# Altium schematic sheet Communication and peripherals.SchDoc
size A4
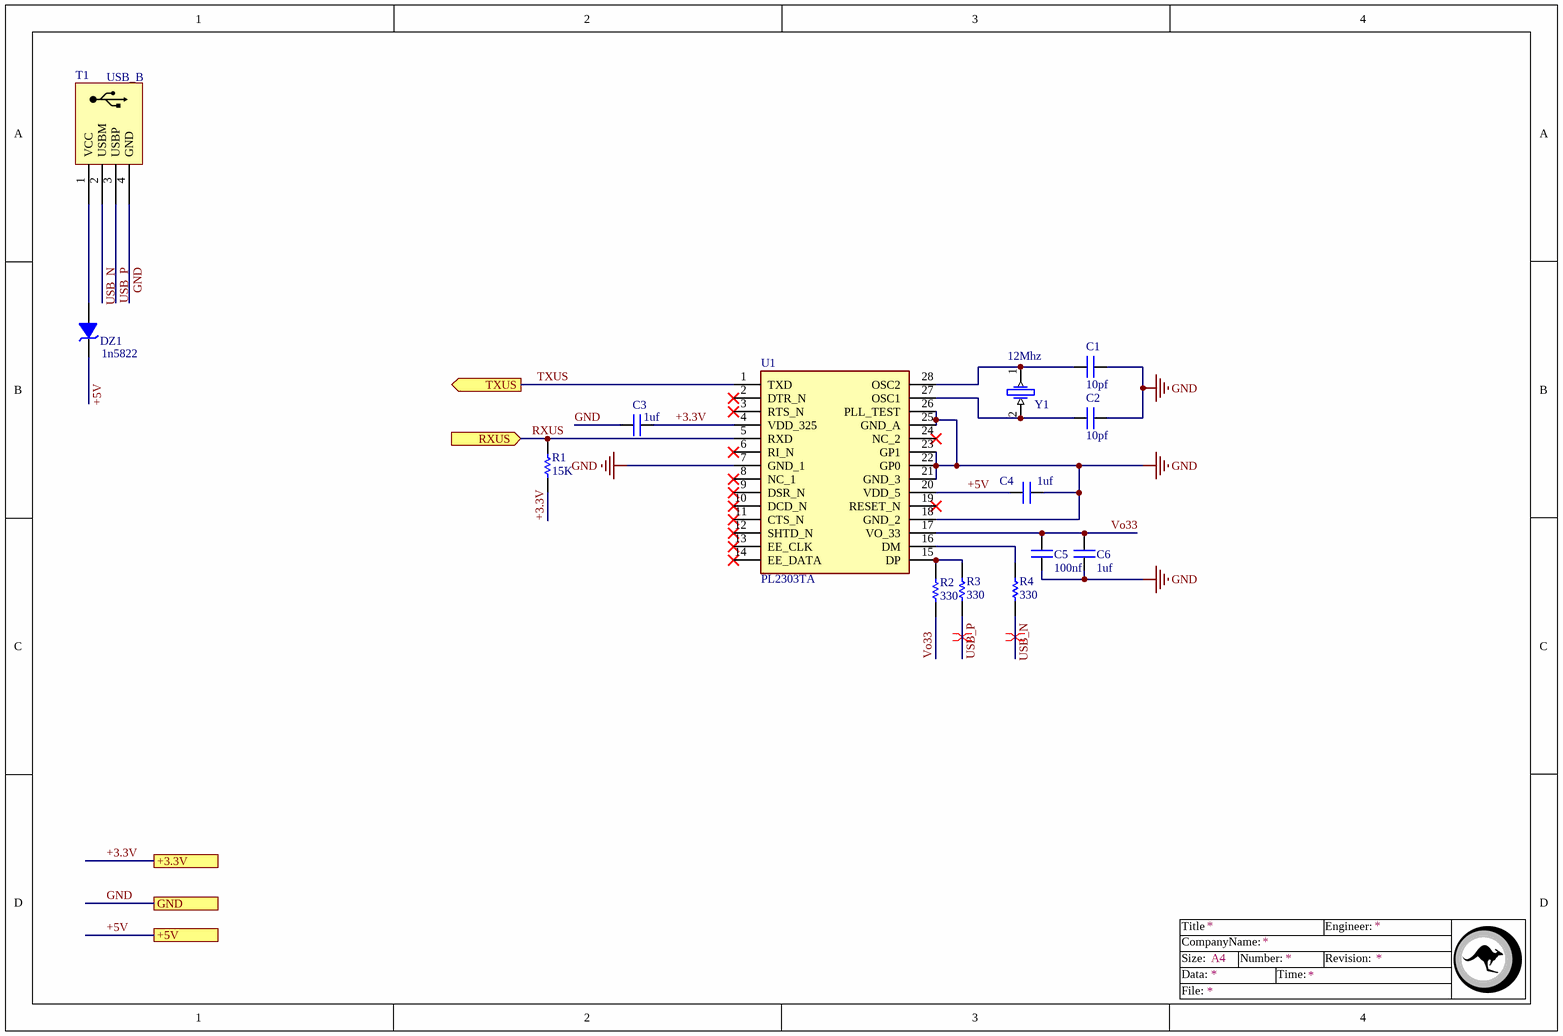
[diagram p0: Communication and peripherals.SchDoc]

## Parts
C1  10pf  [Cap0805]
C2  10pf  [Cap0805]
C3  1uf  [Cap0805]
C4  1uf  [Cap0805]
C5  100nf  [Cap0805]
C6  1uf  [Cap0805]
DZ1  1n5822  [LL4148]
R1  15K  [R0805]
R2  330  [R0805]
R3  330  [R0805]
R4  330  [R0805]
T1  USB_B  [USB_Dip_R]
U1  PL2303TA  [SOP65P780X200-28N]
Y1  12Mhz  [CrystallB]

## Ports
+3.3V, +5V, GND, RXUS (in), TXUS (out)

## Nets
GND: C1.2 C2.2 C3.1 C4.1 C5.1 C6.1 T1.4(GND) U1.7(GND_1) U1.18(GND_2) U1.21(GND_3) U1.22(GP0) U1.23(GP1) U1.25(GND_A) U1.26(PLL_TEST) ; port GND
+3.3V: C3.2 R1.1 U1.4(VDD_325) ; port +3.3V
+5V: C4.2 DZ1.K U1.20(VDD_5) ; port +5V
RXUS: R1.2 U1.5(RXD) ; port RXUS
TXUS: U1.1(TXD) ; port TXUS
USB_N: R4.1 T1.2(USBM)
USB_P: R3.1 T1.3(USBP)
Vo33: C5.2 C6.2 R2.1 U1.17(VO_33)
NetC1_1: C1.1 U1.28(OSC2) Y1.1
NetC2_1: C2.1 U1.27(OSC1) Y1.2
NetDZ1_A: DZ1.A T1.1(VCC)
NetR2_2: R2.2 R3.2 U1.15(DP)
NetR4_2: R4.2 U1.16(DM)

Not connected (* = marked no-connect by the designer): U1 2(DTR_N)* 3(RTS_N)* 6(RI_N)* 8(NC_1)* 9(DSR_N)* 10(DCD_N)* 11(CTS_N)* 12(SHTD_N)* 13(EE_CLK)* 14(EE_DATA)* 19(RESET_N)* 24(NC_2)*

## Layout directives
differential pair: USB_N, USB_P

## Notes on the sheet
- Title
- Size:
- Data:
- CompanyName:
- A4
- Number:
- Time:
- Revision:
- Engineer:
- File:

## Library data of the parts
C1-C6 = Cap: Surface mount Capacitor
DZ1 = Diode Zener
R1-R4 = Resistor
T1 = USB_B: USB B Connector
U1 = PL2303TA: Uart Chip
Y1 = Crystal